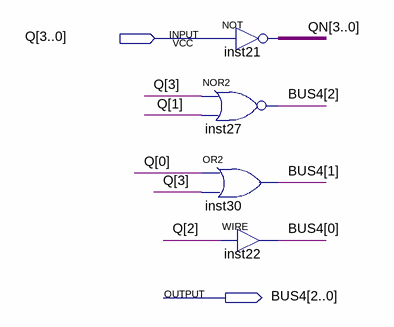
[diagram p0: schematic sheet]
// Quartus schematic BUS4.bdf as structural Verilog: 4 symbols, 2 pins
module BUS4 (
  input  [3:0] Q,
  output [2:0] BUS4
);

  wire [3:0] QN;

  nor inst27 (BUS4[2], Q[3], Q[1]);
  or inst30 (BUS4[1], Q[0], Q[3]);
  assign QN = ~Q;  // NOT inst21, 4 bits wide
  assign BUS4[0] = Q[2];  // WIRE inst22
endmodule
